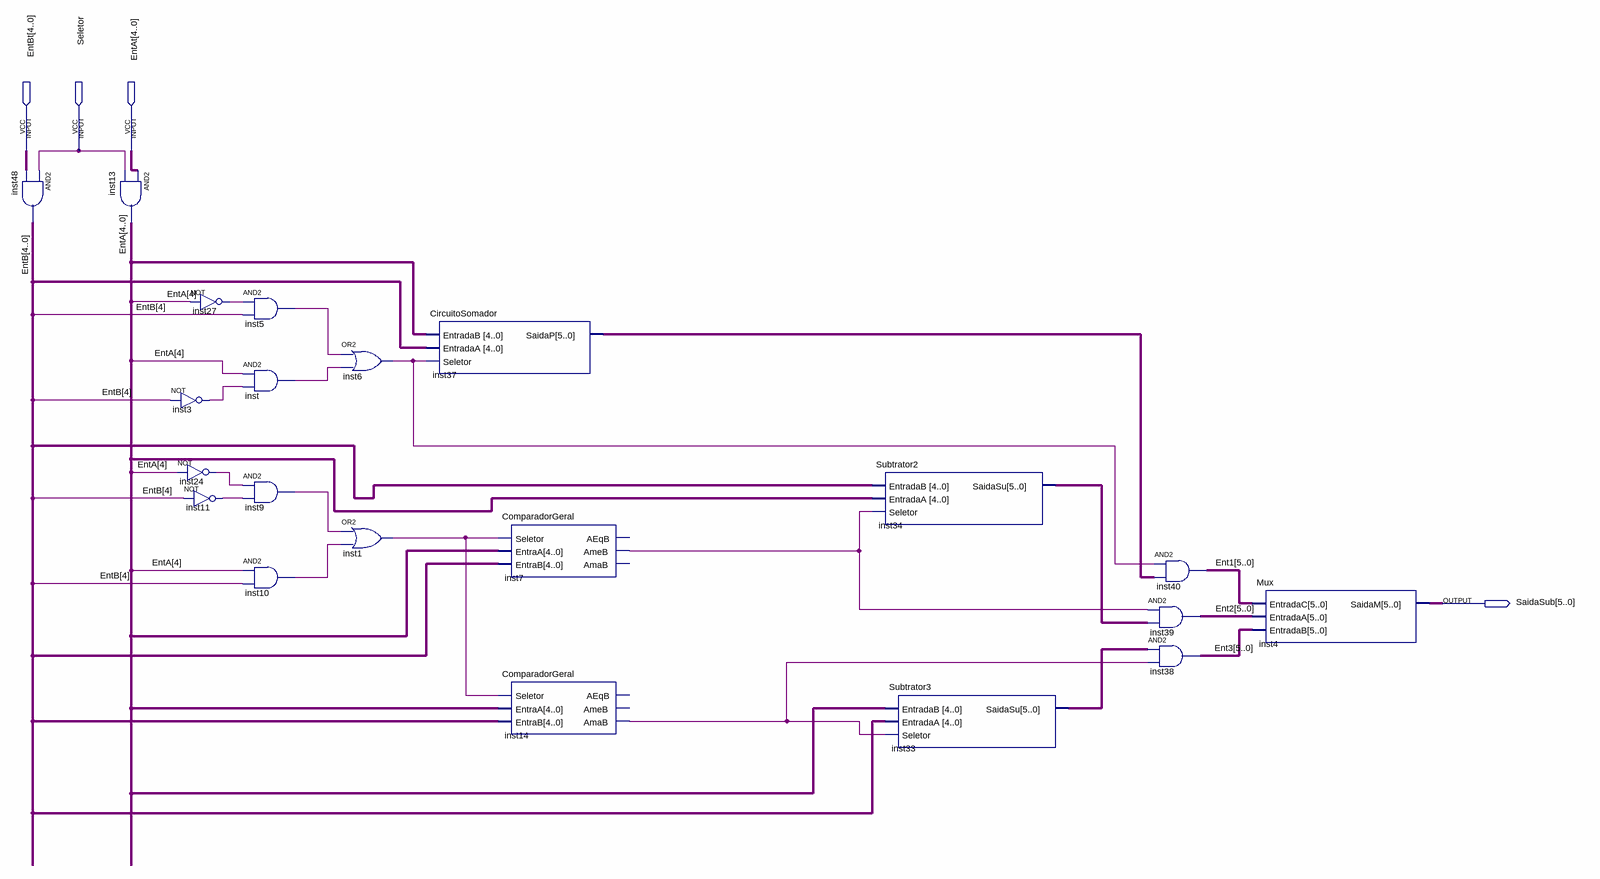
[diagram p0: schematic sheet]
// Quartus schematic CircuitoSubtratorCompleto.bdf as structural Verilog: 21 symbols, 4 pins
module CircuitoSubtratorCompleto (
  input  [4:0] EntBt,
  input  Seletor,
  input  [4:0] EntAt,
  output [5:0] SaidaSub
);

  wire inst1_out, inst3_out, inst5_out, inst6_out, inst7_ameb, inst9_out, inst10_out, inst11_out,
       inst14_amab, inst24_out, inst27_out, inst_out;
  wire [4:0] EntA, EntB;
  wire [5:0] Ent1, Ent2, Ent3, inst33_saidasu, inst34_saidasu, inst37_saidap;

  assign EntB = {5{Seletor}} & EntBt;  // AND2 inst48, 5 bits wide
  assign EntA = EntAt & {5{Seletor}};  // AND2 inst13, 5 bits wide
  not inst27 (inst27_out, EntA[4]);
  not inst3 (inst3_out, EntB[4]);
  not inst24 (inst24_out, EntA[4]);
  not inst11 (inst11_out, EntB[4]);
  and inst5 (inst5_out, inst27_out, EntB[4]);
  and inst (inst_out, EntA[4], inst3_out);
  and inst9 (inst9_out, inst24_out, inst11_out);
  and inst10 (inst10_out, EntA[4], EntB[4]);
  or inst6 (inst6_out, inst5_out, inst_out);
  or inst1 (inst1_out, inst9_out, inst10_out);
  CircuitoSomador inst37 (.EntradaB(EntA), .EntradaA(EntB), .Seletor(inst6_out), .SaidaP(inst37_saidap));
  ComparadorGeral inst7 (.Seletor(inst1_out), .EntraA(EntA), .EntraB(EntB), .AmeB(inst7_ameb));  // open: AEqB, AmaB
  ComparadorGeral inst14 (.Seletor(inst1_out), .EntraA(EntA), .EntraB(EntB), .AmaB(inst14_amab));  // open: AEqB, AmeB
  Subtrator2 inst34 (.EntradaB(EntB), .EntradaA(EntA), .Seletor(inst7_ameb), .SaidaSu(inst34_saidasu));
  Subtrator3 inst33 (.EntradaB(EntA), .EntradaA(EntB), .Seletor(inst14_amab), .SaidaSu(inst33_saidasu));
  assign Ent2 = {6{inst7_ameb}} & inst34_saidasu;  // AND2 inst39, 6 bits wide
  assign Ent3 = inst33_saidasu & {6{inst14_amab}};  // AND2 inst38, 6 bits wide
  assign Ent1 = {6{inst6_out}} & inst37_saidap;  // AND2 inst40, 6 bits wide
  Mux inst4 (.EntradaC(Ent1), .EntradaA(Ent2), .EntradaB(Ent3), .SaidaM(SaidaSub));
endmodule
